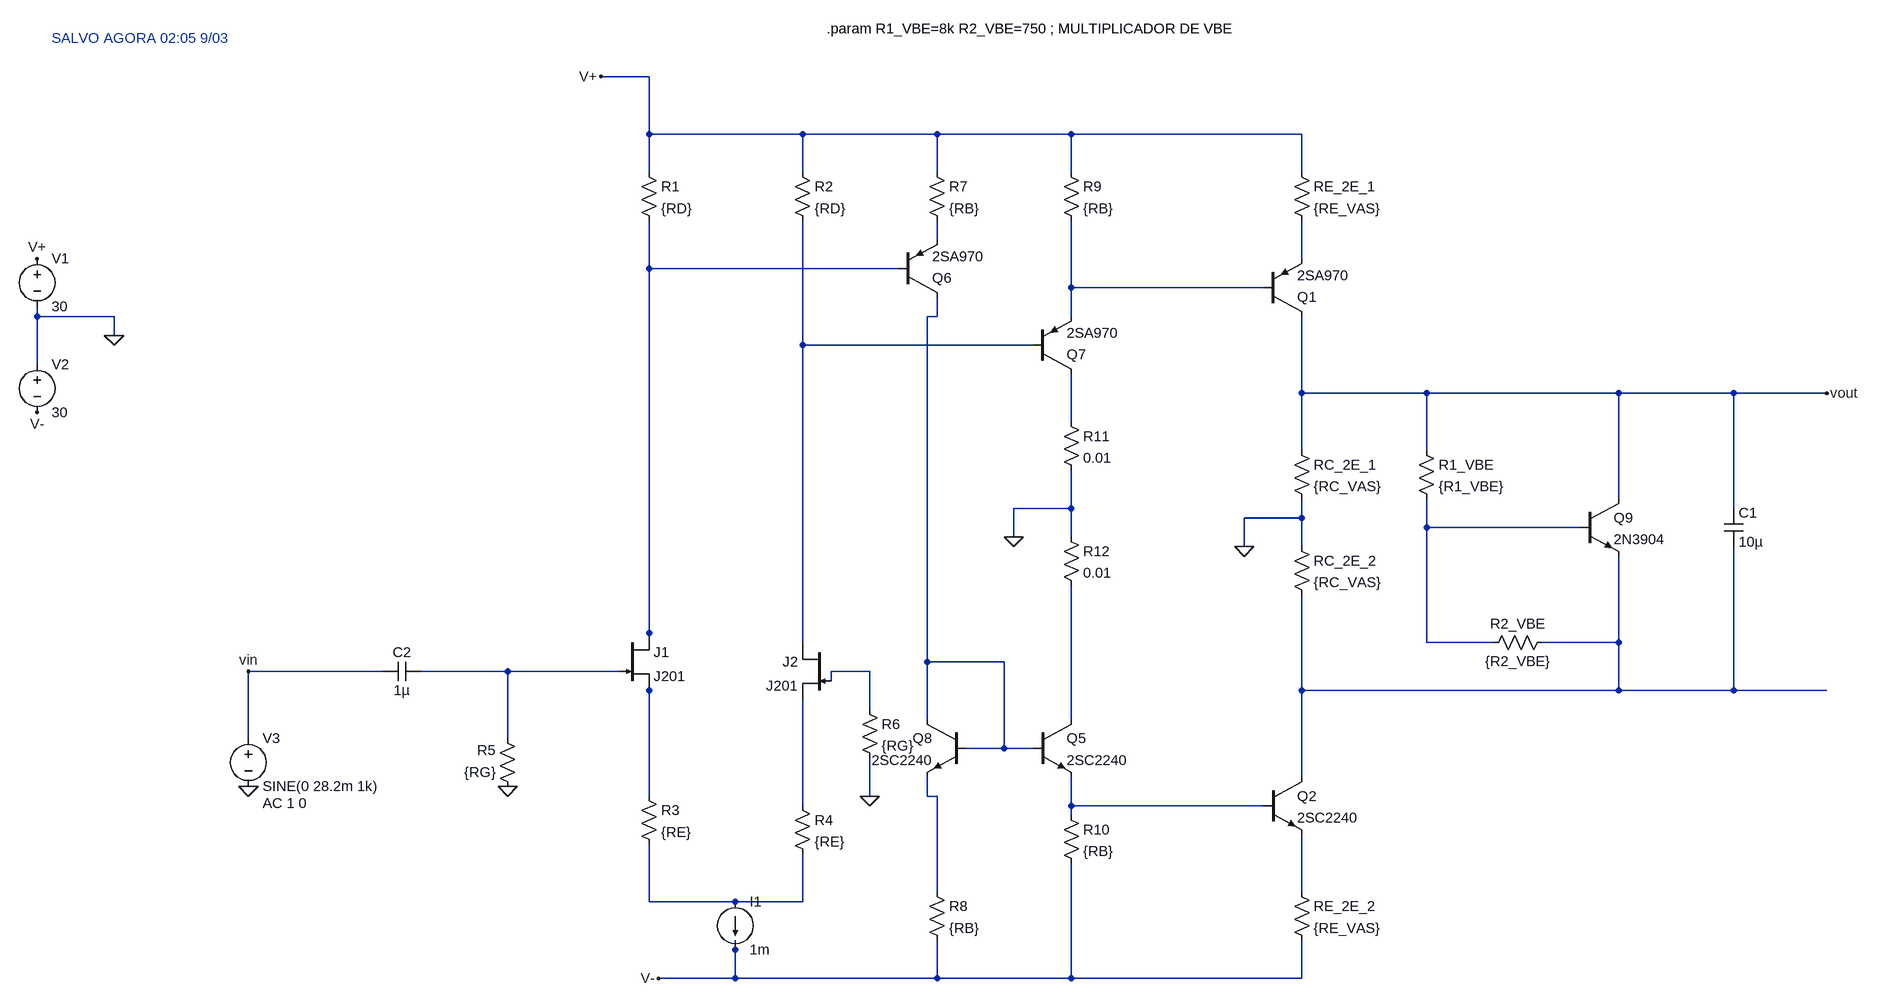
[diagram p0: schematic 2E_JFET_THD.asc]
2E_JFET_THD.asc, the LTspice schematic file:
Version 4
SHEET 1 2256 1192
WIRE -704 -848 -784 -848
WIRE -704 -752 -704 -848
WIRE -448 -752 -704 -752
WIRE -224 -752 -448 -752
WIRE 0 -752 -224 -752
WIRE 384 -752 0 -752
WIRE -704 -688 -704 -752
WIRE -448 -688 -448 -752
WIRE -224 -688 -224 -752
WIRE 0 -688 0 -752
WIRE 384 -688 384 -752
WIRE -224 -576 -224 -608
WIRE 384 -544 384 -608
WIRE -704 -528 -704 -608
WIRE -288 -528 -704 -528
WIRE 0 -496 0 -608
WIRE 320 -496 0 -496
WIRE -1792 -448 -1792 -464
WIRE -1664 -448 -1792 -448
WIRE -224 -448 -224 -480
WIRE -224 -448 -240 -448
WIRE 0 -448 0 -496
WIRE -1664 -416 -1664 -448
WIRE -448 -400 -448 -608
WIRE -64 -400 -448 -400
WIRE -1792 -368 -1792 -448
WIRE 384 -320 384 -448
WIRE 592 -320 384 -320
WIRE 912 -320 592 -320
WIRE 1104 -320 912 -320
WIRE 1744 -320 1104 -320
WIRE 0 -272 0 -352
WIRE 384 -224 384 -320
WIRE 592 -224 592 -320
WIRE 912 -144 912 -320
WIRE 0 -128 0 -192
WIRE 0 -128 -96 -128
WIRE 1104 -128 1104 -320
WIRE 384 -112 384 -144
WIRE 384 -112 288 -112
WIRE 592 -96 592 -144
WIRE 848 -96 592 -96
WIRE -96 -80 -96 -128
WIRE 0 -80 0 -128
WIRE 288 -64 288 -112
WIRE 384 -64 384 -112
WIRE -704 80 -704 -528
WIRE -704 96 -704 80
WIRE -448 96 -448 -400
WIRE 592 96 592 -96
WIRE 704 96 592 96
WIRE 912 96 912 -48
WIRE 912 96 784 96
WIRE -240 128 -240 -448
WIRE -112 128 -240 128
WIRE -1216 144 -1440 144
WIRE -1008 144 -1152 144
WIRE -752 144 -1008 144
WIRE -336 144 -400 144
WIRE -400 160 -400 144
WIRE -704 176 -704 160
WIRE 384 176 384 16
WIRE 912 176 912 96
WIRE 912 176 384 176
WIRE 1104 176 1104 -64
WIRE 1104 176 912 176
WIRE 1744 176 1104 176
WIRE -336 208 -336 144
WIRE -240 224 -240 128
WIRE 0 224 0 0
WIRE -1440 256 -1440 144
WIRE -1008 256 -1008 144
WIRE -112 272 -112 128
WIRE -112 272 -176 272
WIRE -64 272 -112 272
WIRE 384 320 384 176
WIRE -704 352 -704 176
WIRE -336 352 -336 288
WIRE -240 352 -240 320
WIRE -224 352 -240 352
WIRE -448 368 -448 192
WIRE 0 368 0 320
WIRE 320 368 0 368
WIRE 0 384 0 368
WIRE -224 512 -224 352
WIRE 384 512 384 416
WIRE -704 528 -704 432
WIRE -560 528 -704 528
WIRE -448 528 -448 448
WIRE -448 528 -560 528
WIRE -560 608 -560 592
WIRE -560 656 -560 608
WIRE -560 656 -688 656
WIRE -224 656 -224 592
WIRE -224 656 -560 656
WIRE 0 656 0 464
WIRE 0 656 -224 656
WIRE 384 656 384 592
WIRE 384 656 0 656
FLAG -1664 -416 0
FLAG -1792 -544 V+
FLAG -1792 -288 V-
FLAG -336 352 0
FLAG -688 656 V-
FLAG -784 -848 V+
FLAG -1440 336 0
FLAG -1008 336 0
FLAG 288 -64 0
FLAG -96 -80 0
FLAG -1440 144 vin
FLAG 1744 -320 vout
DATAFLAG 912 -320 ""
DATAFLAG 912 96 ""
DATAFLAG -16 -128 ""
DATAFLAG 0 -304 ""
DATAFLAG 0 64 ""
SYMBOL pnp 320 -448 M180
SYMATTR InstName Q1
SYMATTR Value 2SA970
SYMBOL res 368 -704 R0
SYMATTR InstName RE_2E_1
SYMATTR Value {RE_VAS}
SYMBOL res 368 -240 R0
SYMATTR InstName RC_2E_1
SYMATTR Value {RC_VAS}
SYMBOL res 368 -80 R0
SYMATTR InstName RC_2E_2
SYMATTR Value {RC_VAS}
SYMBOL npn 320 320 R0
SYMATTR InstName Q2
SYMATTR Value 2SC2240
SYMBOL res 368 496 R0
SYMATTR InstName RE_2E_2
SYMATTR Value {RE_VAS}
SYMBOL res 576 -240 R0
SYMATTR InstName R1_VBE
SYMATTR Value {R1_VBE}
SYMBOL res 800 80 R90
WINDOW 0 0 56 VBottom 2
WINDOW 3 32 56 VTop 2
SYMATTR InstName R2_VBE
SYMATTR Value {R2_VBE}
SYMBOL voltage -1792 -560 R0
WINDOW 123 0 0 Left 0
WINDOW 39 0 0 Left 0
SYMATTR InstName V1
SYMATTR Value 30
SYMBOL voltage -1792 -384 R0
WINDOW 123 0 0 Left 0
WINDOW 39 0 0 Left 0
SYMATTR InstName V2
SYMATTR Value 30
SYMBOL current -560 528 R0
WINDOW 123 0 0 Left 0
WINDOW 39 0 0 Left 0
SYMATTR InstName I1
SYMATTR Value 1m
SYMBOL res -720 -704 R0
SYMATTR InstName R1
SYMATTR Value {RD}
SYMBOL res -464 -704 R0
SYMATTR InstName R2
SYMATTR Value {RD}
SYMBOL res -240 -704 R0
SYMATTR InstName R7
SYMATTR Value {RB}
SYMBOL res -16 -704 R0
SYMATTR InstName R9
SYMATTR Value {RB}
SYMBOL res -240 496 R0
SYMATTR InstName R8
SYMATTR Value {RB}
SYMBOL res -16 368 R0
SYMATTR InstName R10
SYMATTR Value {RB}
SYMBOL npn -64 224 R0
SYMATTR InstName Q5
SYMATTR Value 2SC2240
SYMBOL pnp -288 -480 M180
SYMATTR InstName Q6
SYMATTR Value 2SA970
SYMBOL pnp -64 -352 M180
SYMATTR InstName Q7
SYMATTR Value 2SA970
SYMBOL res -720 336 R0
SYMATTR InstName R3
SYMATTR Value {RE}
SYMBOL res -464 352 R0
SYMATTR InstName R4
SYMATTR Value {RE}
SYMBOL cap 1088 -128 R0
SYMATTR InstName C1
SYMATTR Value 10µ
SYMBOL voltage -1440 240 R0
WINDOW 123 24 124 Left 2
WINDOW 39 0 0 Left 0
SYMATTR Value2 AC 1 0
SYMATTR InstName V3
SYMATTR Value SINE(0 28.2m 1k)
SYMBOL res -992 352 R180
WINDOW 0 36 76 Left 2
WINDOW 3 36 40 Left 2
SYMATTR InstName R5
SYMATTR Value {RG}
SYMBOL npn -176 224 M0
SYMATTR InstName Q8
SYMATTR Value 2SC2240
SYMBOL res -352 192 R0
SYMATTR InstName R6
SYMATTR Value {RG}
SYMBOL npn 848 -144 R0
SYMATTR InstName Q9
SYMATTR Value 2N3904
SYMBOL njf -752 80 R0
SYMATTR InstName J1
SYMATTR Value J201
SYMBOL njf -400 96 M0
SYMATTR InstName J2
SYMATTR Value J201
SYMBOL cap -1152 128 R90
WINDOW 0 0 32 VBottom 2
WINDOW 3 32 32 VTop 2
SYMATTR InstName C2
SYMATTR Value 1µ
SYMBOL res -16 -288 R0
SYMATTR InstName R11
SYMATTR Value 0.01
SYMBOL res -16 -96 R0
SYMATTR InstName R12
SYMATTR Value 0.01
TEXT -408 -928 Left 2 !.param R1_VBE=8k R2_VBE=750 ; MULTIPLICADOR DE VBE
TEXT -1768 -912 Left 2 ;SALVO AGORA 02:05 9/03

The netlist it stands for:
* 2E_JFET_THD.asc
Q1 vout N004 N002 0 2SA970
RE_2E_1 V+ N002 {RE_VAS}
RC_2E_1 vout 0 {RC_VAS}
RC_2E_2 0 N009 {RC_VAS}
Q2 N009 N016 N017 0 2SC2240
RE_2E_2 N017 V- {RE_VAS}
R1_VBE vout N008 {R1_VBE}
R2_VBE N009 N008 {R2_VBE}
V1 V+ 0 30
V2 0 V- 30
I1 N018 V- 1m
R1 V+ N003 {RD}
R2 V+ N006 {RD}
R7 V+ N001 {RB}
R9 V+ N004 {RB}
R8 N014 V- {RB}
R10 N016 V- {RB}
Q5 N013 N005 N016 0 2SC2240
Q6 N005 N003 N001 0 2SA970
Q7 N007 N006 N004 0 2SA970
R3 N012 N018 {RE}
R4 N015 N018 {RE}
C1 vout N009 10µ
V3 vin 0 SINE(0 28.2m 1k) AC 1 0
R5 0 N010 {RG}
Q8 N005 N005 N014 0 2SC2240
R6 N011 0 {RG}
Q9 vout N008 N009 0 2N3904
J1 N003 N010 N012 J201
J2 N006 N011 N015 J201
C2 N010 vin 1µ
R11 N007 0 0.01
R12 0 N013 0.01
.model NPN NPN
.model PNP PNP
.lib standard.bjt
.model NJF NJF
.model PJF PJF
.lib standard.jft
.param R1_VBE=8k R2_VBE=750 ; MULTIPLICADOR DE VBE
* SALVO AGORA 02:05 9/03
.backanno
.end